# Altium schematic sheet COVER_PAGE.SchDoc
size A4; SheetNumber: 2; SheetTotal: 15
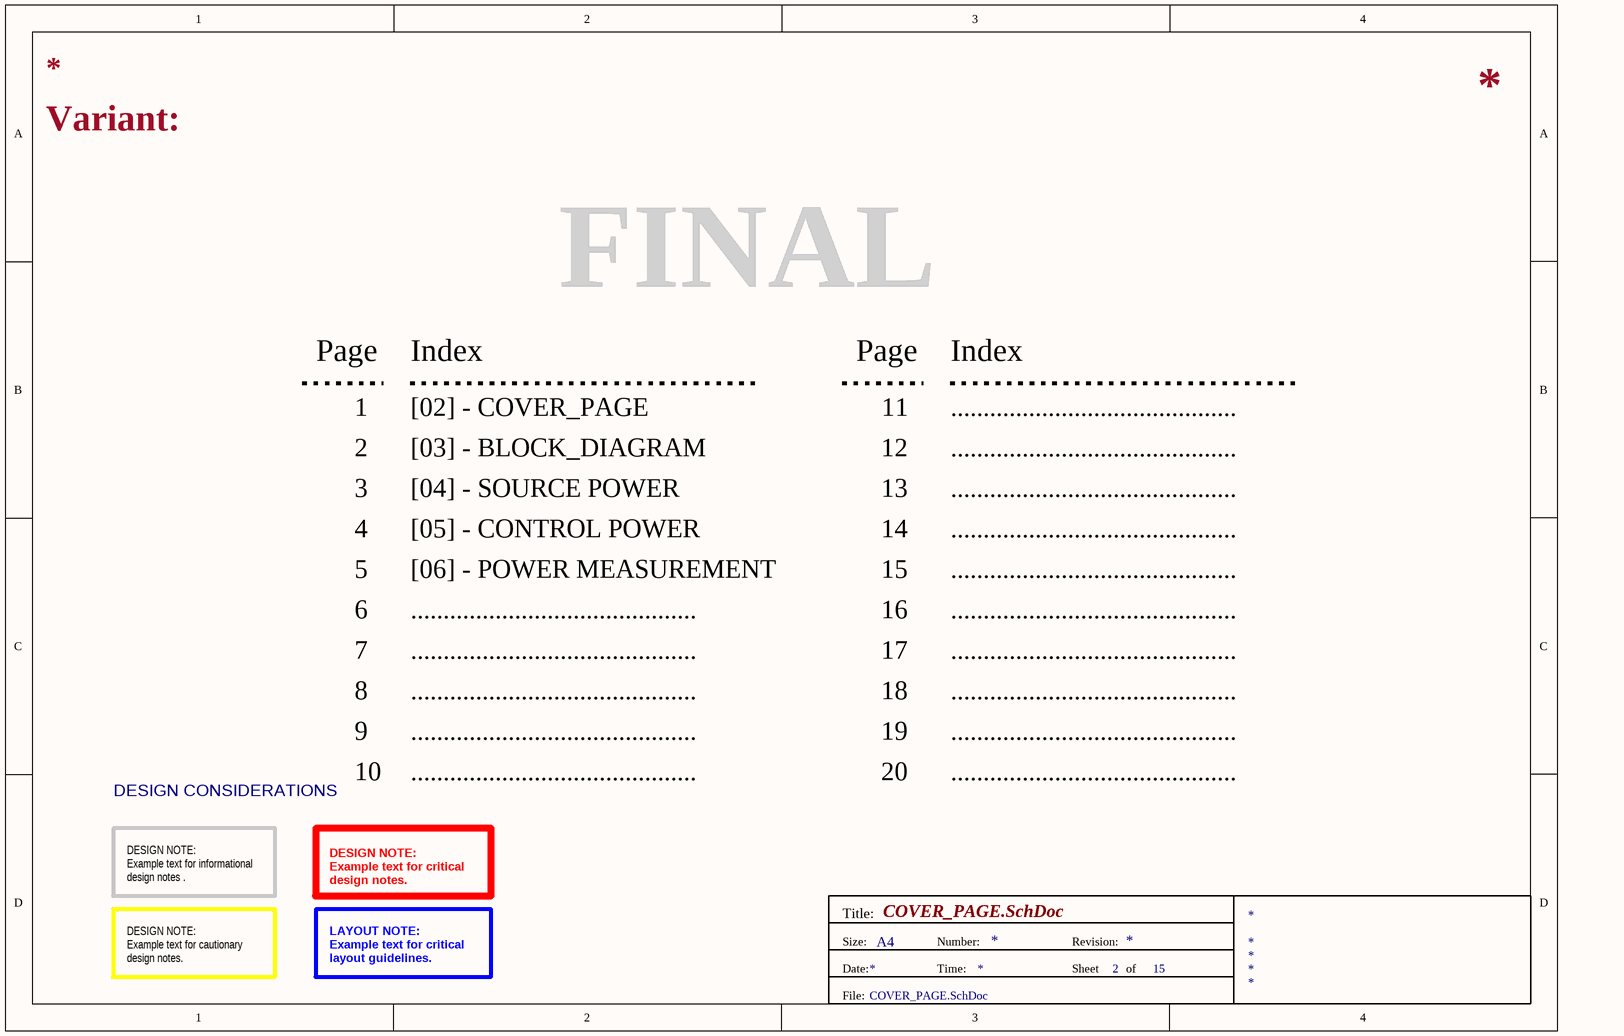
[diagram p0: COVER_PAGE.SchDoc]

## Notes on the sheet
- Variant:
- FINAL
- Page
- Index
- 1
- [02] - COVER_PAGE
- 11
- ............................................
- 2
- 3
- [03] - BLOCK_DIAGRAM
- [04] - SOURCE POWER
- 12
- 13
- 4
- 5
- [05] - CONTROL POWER
- [06] - POWER MEASUREMENT
- 14
- 15
- 6
- 16
- 7
- 8
- 17
- 18
- 9
- 10
- 19
- 20
- DESIGN CONSIDERATIONS
- DESIGN NOTE:
  Example text for informational
  design notes .
- DESIGN NOTE:
  Example text for critical
  design notes.
- Title:
- DESIGN NOTE:
  Example text for cautionary
  design notes.
- LAYOUT NOTE:
  Example text for critical
  layout guidelines.
- Size:
- Date:
- A4
- Number:
- Time:
- Revision:
- Sheet
- of
- File: